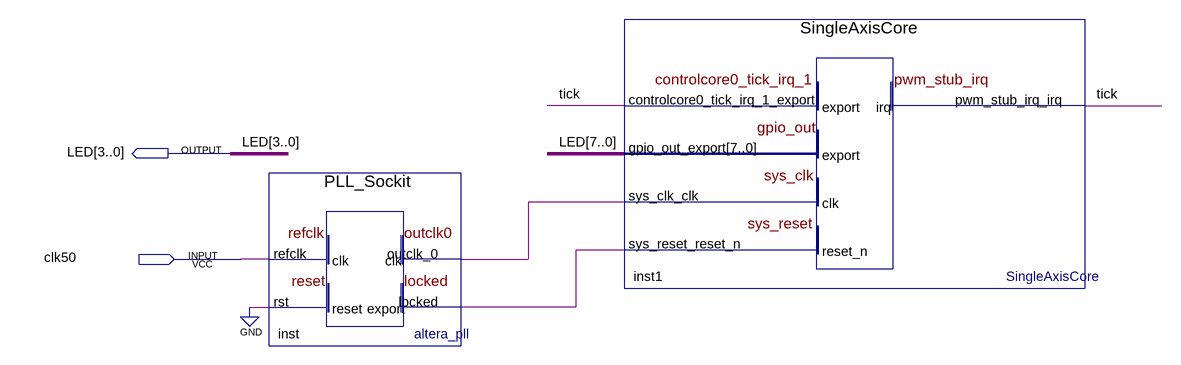
[diagram p0: schematic sheet]
// Quartus schematic SingleCoreTest.bdf as structural Verilog: 2 symbols, 2 pins
module SingleCoreTest (
  input  clk50,
  output [7:0] LED
);

  wire inst_locked, inst_outclk_0, tick;

  PLL_Sockit inst (.refclk(clk50), .rst(1'b0), .outclk_0(inst_outclk_0), .locked(inst_locked));
  SingleAxisCore inst1 (
    .controlcore0_tick_irq_1_export(tick), .sys_clk_clk(inst_outclk_0), .sys_reset_reset_n(inst_locked),
    .gpio_out_export(LED), .pwm_stub_irq_irq(tick));
endmodule
